# Altium schematic sheet schematic.SchDoc
size A4; SheetNumber: 1; SheetTotal: 1
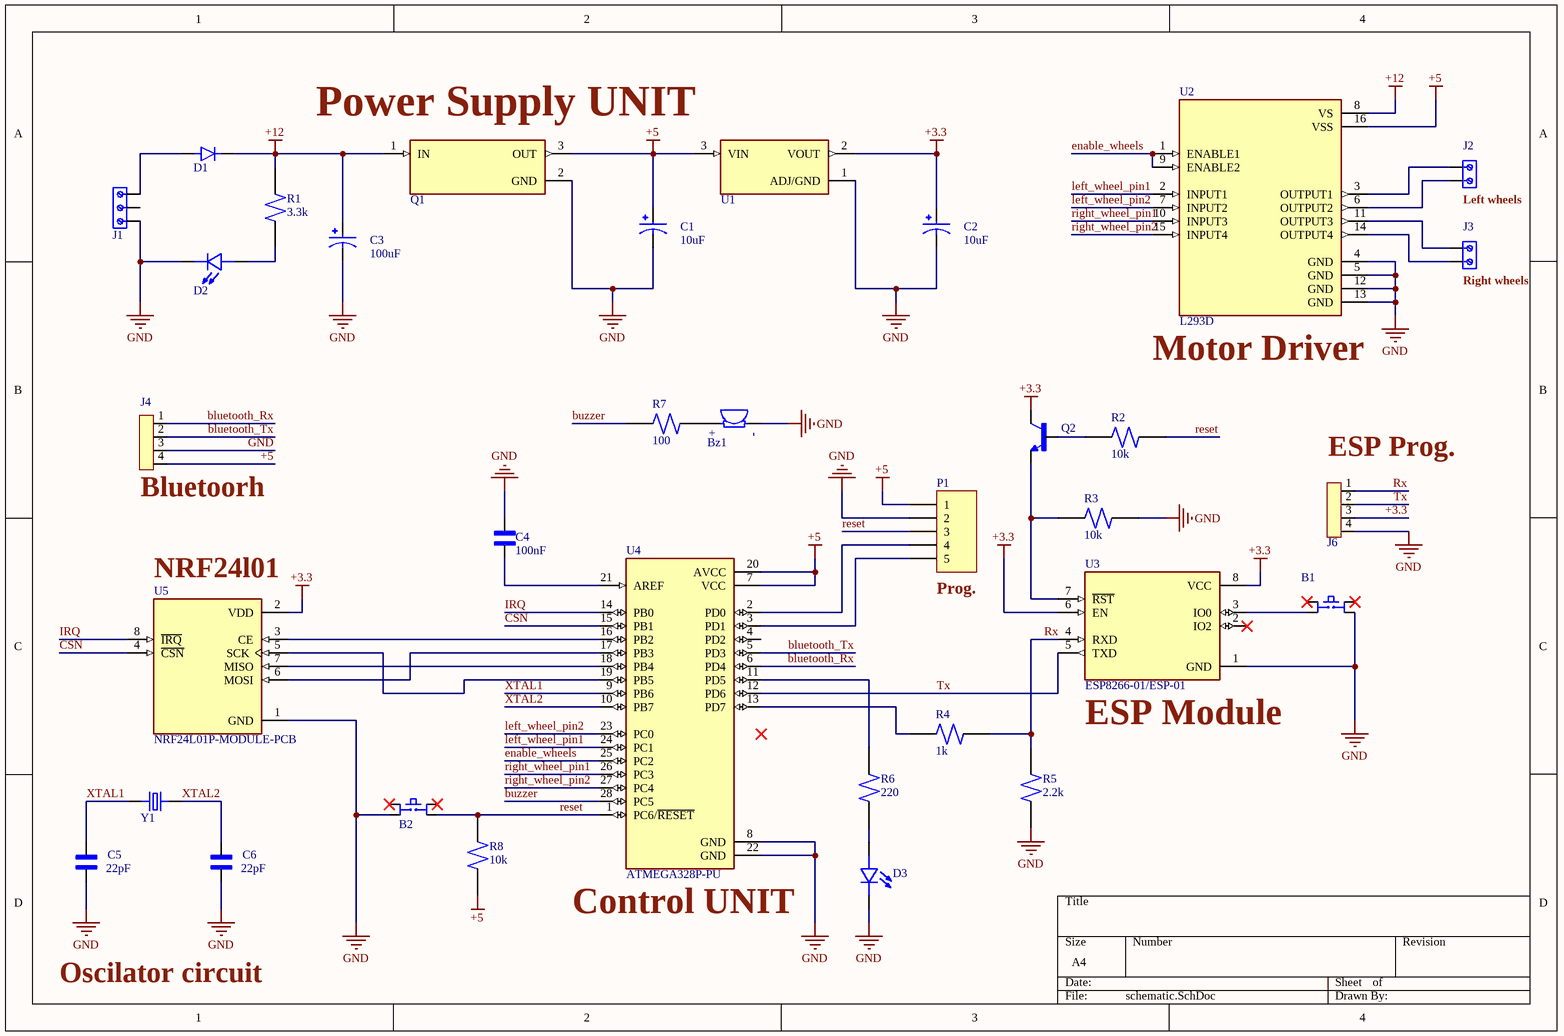
[diagram p0: schematic.SchDoc]

## Parts
B1  Push button  [SW_TS02-66-95-BK-260-LCR-D]  (value not drawn)
B2  Push button  [SW_TS02-66-95-BK-260-LCR-D]  (value not drawn)
Bz1  AI-1223-TWT-12V-R  [XDCR_AI-1223-TWT-12V-R]  (value not drawn)
C1  10uF  [CAPPRD500W50D500H1100]
C2  10uF  [CAPPRD500W50D500H1100]
C3  100uF  [CAPPRD500W50D500H1100]
C4  100nF  [CAPRB500W50L450T300H550]
C5  22pF  [CAPRB500W50L450T300H550]
C6  22pF  [CAPRB500W50L450T300H550]
D1  1N4007  [DIOAD1060W70L435D230]  (value not drawn)
D2  L08R5000Q1  [LEDRD254W57D500H1070]  (value not drawn)
D3  L08R5000Q1  [LEDRD254W57D500H1070]  (value not drawn)
J1  691214110003  [691214110003]  (value not drawn)
J2  691111710002  [691111710002]  (value not drawn)
J3  691111710002  [691111710002]  (value not drawn)
J4  PPTC041LFBN-RC  [SULLINS_PPTC041LFBN-RC]  (value not drawn)
J6  PPTC041LFBN-RC  [SULLINS_PPTC041LFBN-RC]  (value not drawn)
P1  Header 5  [HDR1X5]  (value not drawn)
Q1  5V Regulator  [TO254P1054X470X1955-3]  (value not drawn)
Q2  BJT Transistor  [TO92250P510H770-3]  (value not drawn)
R1  3.3k  [RESAD1100W55L680D260]
R2  10k  [RESAD1100W55L680D260]
R3  10k  [RESAD1100W55L680D260]
R4  1k  [RESAD1100W55L680D260]
R5  2.2k  [RESAD1100W55L680D260]
R6  220  [RESAD1100W55L680D260]
R7  100  [RESAD1100W55L680D260]
R8  10k  [RESAD1100W55L680D260]
U1  3.3V Regulator  [TO255P1020X450X1968-3]  (value not drawn)
U2  L293D  [DIP880W50P254L2000H510Q16]
U3  ESP8266-01/ESP-01  [XCVR_ESP8266-01/ESP-01]
U4  ATMEGA328P-PU  [DIP794W46P254L2967H457Q28B]
U5  NRF24L01P-MODULE-PCB  [XCVR_NRF24L01P-MODULE-PCB]
Y1  ECS-160-S-4  [XTAL_ECS-160-20-4X]  (value not drawn)

## Nets
+3.3: C2.P J6.3 Q2.1(C) U1.2(VOUT) U3.6(EN) U3.8(VCC) U5.2(VDD)
+5: C1.P J4.4 P1.1 Q1.3(OUT) R8.1 U1.3(VIN) U2.16(VSS) U4.7(VCC) U4.20(AVCC)
+12: C3.P D1.C Q1.1(IN) R1.2 U2.8(VS)
GND: B1.4 B2.2 Bz1.N(NEG) C1.N C2.N C3.N C4.1 C5.1 C6.1 D2.C D3.C J1.1 J4.3 J6.4 P1.2 Q1.2(GND) R3.2 R5.1 U1.1(ADJ/GND) U2.4(GND) U2.5(GND) U2.12(GND) U2.13(GND) U3.1(GND) U4.8(GND) U4.22(GND) U5.1(GND)
bluetooth_Rx: J4.1 U4.6(PD4)
bluetooth_Tx: J4.2 U4.5(PD3)
buzzer: R7.1 U4.28(PC5)
CSN: U4.15(PB1) U5.4(~{CSN})
enable_wheels: U2.1(ENABLE1) U2.9(ENABLE2) U4.25(PC2)
IRQ: U4.14(PB0) U5.8(~{IRQ})
left_wheel_pin1: U2.2(INPUT1) U4.24(PC1)
left_wheel_pin2: U2.7(INPUT2) U4.23(PC0)
reset: B2.4 P1.3 R2.2 R8.2 U4.1(PC6/~{RESET})
right_wheel_pin1: U2.10(INPUT3) U4.26(PC3)
right_wheel_pin2: U2.15(INPUT4) U4.27(PC4)
Rx: J6.1 R4.1 R5.2 U3.4(RXD)
Tx: J6.2 U3.5(TXD) U4.12(PD6)
XTAL1: C5.2 U4.9(PB6) Y1.1
XTAL2: C6.2 U4.10(PB7) Y1.2
NetB1_2: B1.2 U3.3(IO0)
NetBz1_P: Bz1.P(POS) R7.2
NetC4_2: C4.2 U4.21(AREF)
NetD1_A: D1.A J1.3
NetD2_A: D2.A R1.1
NetD3_A: D3.A R6.2
NetJ2_1: J2.1 U2.3(OUTPUT1)
NetJ2_2: J2.2 U2.6(OUTPUT2)
NetJ3_1: J3.1 U2.11(OUTPUT3)
NetJ3_2: J3.2 U2.14(OUTPUT4)
NetP1_4: P1.4 U4.2(PD0)
NetP1_5: P1.5 U4.3(PD1)
NetQ2_2: Q2.2(B) R2.1
NetQ2_3: Q2.3(E) R3.1 U3.7(~{RST})
NetR4_2: R4.2 U4.13(PD7)
NetR6_1: R6.1 U4.11(PD5)
NetU4_16: U4.16(PB2) U5.3(CE)
NetU4_17: U4.17(PB3) U5.6(MOSI)
NetU4_18: U4.18(PB4) U5.7(MISO)
NetU4_19: U4.19(PB5) U5.5(SCK)

Not connected (* = marked no-connect by the designer): B1 1* 3*; B2 1* 3*; J1 2; U3 2(IO2)*; U4 4(PD2)

## Notes on the sheet
- Power Supply UNIT
- (near J2) Left wheels
- (near J3) Right wheels
- (near U2) Motor Driver
- (near J4) Bluetoorh
- (near J6) ESP Prog.
- (near U5) NRF24l01
- (near P1) Prog.
- (near U3) ESP Module
- (near U4) Control UNIT
- Oscilator circuit
- (in symbol Buzzer) +; -

## Library data of the parts
Bz1 = Buzzer: ELECTRO-MECHANICAL AUDIO INDICATOR; MF: PUI Audio,; Availability: In Stock; Package: 2225 PUI Audio; Value: *; Price: None; MP: AI-1223-TWT-12V-R; Purchase-URL: https://pricing.snapeda.com/search/part/AI-1223-TWT-12V-R/?ref=eda
C1-C3 = Electrolytic capacitor: FS-A; MF: {'manufacturer': u'Panasonic'}; MP: EEUFS0J221B; Package: None; Value: *; Availability: Unavailable; Price: None
C4-C6 = Ceramic capacitor: 2200 pF Â±10% 250V Ceramic Capacitor X7R Radial; MF: TDK; MP: FG24X7R2E222KNT06; Digi-Key_Part_Number: 445-173386-1-ND; Purchase-URL: https://pricing.snapeda.com/search/part/FG24X7R2E222KNT06/?ref=eda; Check_prices: https://www.snapeda.com/parts/FG24X7R2E222KNT06/TDK/view-part/?ref=eda; Value: *; Package: Radial TDK; SnapEDA_Link: https://www.snapeda.com/parts/FG24X7R2E222KNT06/TDK/view-part/?ref=snap
D1 = Diode: Diode Switching 1KV 1A 2-Pin DO-41; Price: None; MP: 1N4007; Value: *; Availability: Unavailable; Package: None
D2 D3 = LED: LED, Orange, Through Hole, T-1 3/4 (5mm), 30 mA, 2.1 V, 635 nm; MF: {'manufacturer': u'LED Technology'}; Price: None; Package: None; Availability: Unavailable; MP: L08R5000Q1; Value: *
J1 = Terminal blocks - 3Pins (Small): 3 Position Wire to Board Terminal Block Horizontal with Board 0.138 (3.50mm) Through Hole; MF: Wurth Elektronik; Price: None; SnapEDA_Link: https://www.snapeda.com/parts/691214110003/Wurth+Elektronik/view-part/?ref=snap; Purchase-URL: https://pricing.snapeda.com/search/part/691214110003/?ref=eda; Availability: In Stock; MP: 691214110003; Package: None; Check_prices: https://www.snapeda.com/parts/691214110003/Wurth+Elektronik/view-part/?ref=eda; Value: *
J2 J3 = Terminal Block - 2Pins: 2 Position Wire to Board Terminal Block Horizontal with Board 0.197 _5.00mm_ Through Hole; MF: Wurth Electronics; Value: *; Availability: Unavailable; MP: 691111710002; Price: None; Package: None; SnapEDA_Link: https://www.snapeda.com/parts/691111710002/Wurth%20Electronics%20Inc./view-part/1195092/?ref=snap
J4 J6 = Female header - 4Pins: 4 Position Header Connector Through Hole; MF: Sullins Connector; MP: PPTC041LFBN-RC; Value: *; SnapEDA_Link: https://www.snapeda.com/parts/PPTC041LFBN-RC/Sullins%20Connector%20Solutions/view-part/285917/?ref=snap; Package: None; Availability: Warning; Check_prices: https://www.snapeda.com/parts/PPTC041LFBN-RC/Sullins%20Connector%20Solutions/view-part/285917/?ref=eda; Price: None; Purchase-URL: https://pricing.snapeda.com/search/part/PPTC041LFBN-RC/?ref=eda
P1 = Header 5: Header, 5-Pin; LatestRevisionDate: 17-Jul-2002; LatestRevisionNote: Re-released for DXP Platform.; Publisher: Altium Limited
Q1 = LM7805: MP: LM7805CT/NOPB; Price: None; Value: *; Availability: Unavailable; Package: None
Q2 = BC547B: <a href="https://pricing.snapeda.com/parts/BC337-16%20A1/Taiwan%20Semiconductor/view-part?ref=eda">Check availability</a> <a href="https://pricing.snapeda.com/parts/BC337-16%20A1/Taiwan%20Semiconductor/view-part?ref=eda">Check availability</a>; Price: None; Value: *; Package: None; Availability: Unavailable; MP: BC547B
R1-R8 = Resistor (0.25W): (MFR-25FBF52-10K) 10,2 kOhm bei 1% 0,25W, 1/4W Durchbohrlochwiderstand Axial Metal Film; MF: Yageo; Digi-Key_Part_Number: 10.2KXBK-ND; SnapEDA_Link: https://www.snapeda.com/parts/MFR-25FBF52-10K/Yageo/view-part/424333/?ref=snap; Package: Axial Yageo; Purchase-URL: https://pricing.snapeda.com/search/part/MFR-25FBF52-10K/?ref=eda; MP: MFR-25FBF52-10K; Value: *
U1 = LD1117V33: Package: None; MP: LD1117V33; Price: None; Availability: Unavailable; Value: *
U2 = L293D: 4-Channel Motor Driver 24V 16-Pin Power PDIP Tube; Price: None; Package: None; Availability: Unavailable; MP: L293D; Value: *
U3 = ESP8266-01 Module: MakerFocus 4pcs ESP8266 ESP-01 Serial Wireless WiFi Transceiver Receiver Module 1MB SPI Flash DC3.0-3.6V Internet of Things WiFi Module Board Compatible with Ar duino; Value: *; MP: ESP8266-01/ESP-01; Package: None; Availability: Unavailable; Price: None
U4 = ATMEGA328P-PU: ATmega Series 20 MHz 32 KB Flash 2 KB SRAM 8-Bit Microcontroller - DIP-28; Value: *; MP: ATMEGA328P-PU; Package: None; Availability: Unavailable; Price: None
U5 = NRF24L01P-MODULE-PCB: - Transceiver For Use With nRF24L01+; MF: Nordic Semiconductor; Package: None; MP: NRF24L01P-MODULE-PCB; Value: *; Availability: Bad; Price: None; SnapEDA_Link: https://www.snapeda.com/parts/NRF24L01P-MODULE-PCB/Nordic%20Semiconductor%20ASA/view-part/230534/?ref=snap; Mouser-Purchase-URL: https://snapeda.com/shop?store=Mouser&id=230534
Y1 = Crystal oscilator: CRYSTAL T/H; MF: {'manufacturer': u'ECS Inc.'}; Package: None; Value: *; MP: ECS-160-S-4; Availability: Unavailable; Price: None